# EAGLE design Osillatore Variabile Intonazione (EAGLE 7.6.0)
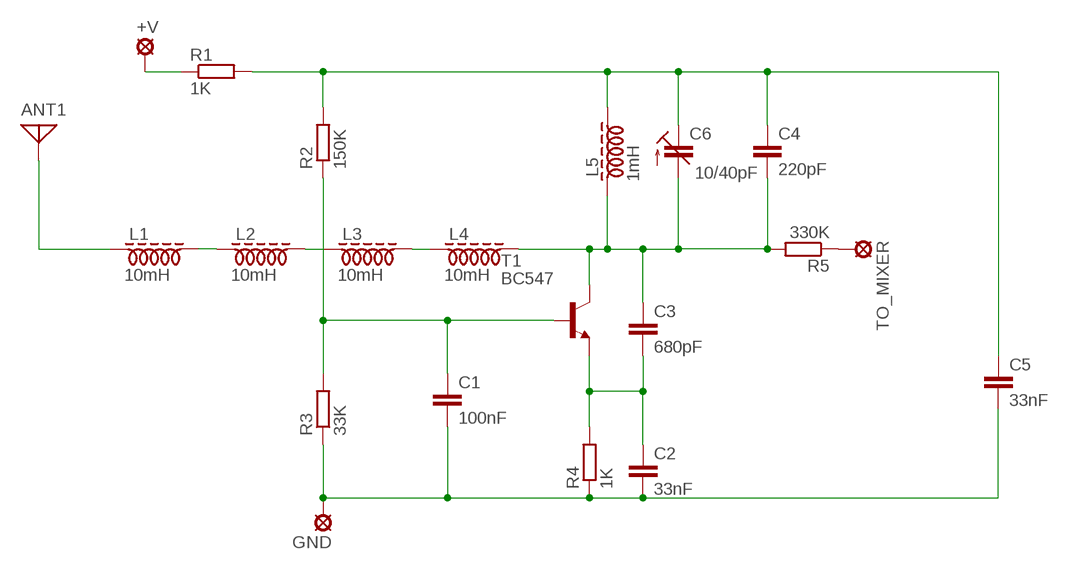
[diagram p0: schematic, sheet 1]

## Parts
+V  LSP10  [LSP10]
ANT1  ANTENNA  [PAD-01]
C1  100nF  C-EU025-060X050  [C025-060X050]
C2  33nF  C-EU025-060X050  [C025-060X050]
C3  680pF  C-EU025-060X050  [C025-060X050]
C4  220pF  C-EU025-060X050  [C025-060X050]
C5  33nF  C-EU025-060X050  [C025-060X050]
C6  10/40pF  C-TRIMM3008  [3008]
GND  LSP10  [LSP10]
L1  10mH  Z28/70CW  [Z28/7]
L2  10mH  Z28/70CW  [Z28/7]
L3  10mH  Z28/70CW  [Z28/7]
L4  10mH  Z28/70CW  [Z28/7]
L5  1mH  Z28/70CW  [Z28/7]
R1  1K  R-EU_0207/7  [0207/7]
R2  150K  R-EU_0207/7  [0207/7]
R3  33K  R-EU_0207/7  [0207/7]
R4  1K  R-EU_0207/7  [0207/7]
R5  330K  R-EU_0207/7  [0207/7]
T1  BC547  [TO92]
TO_MIXER  LSP10  [LSP10]

## Nets
N$1: C4.1 C5.1 C6.+(E) L5.2 R1.2 R2.2
N$2: ANT1.1 L1.1
N$3: L1.2 L2.1
N$4: L2.2 L3.1
N$5: L3.2 L4.1
N$6: C3.1 C4.2 C6.-(A) L4.2 L5.1 R5.2 T1.3(C)
N$7: C1.1 R2.1 R3.2 T1.2(B)
N$8: +V.MP R1.1
N$9: C2.1 C3.2 R4.2 T1.1(E)
N$12: R5.1 TO_MIXER.MP
N$14: C1.2 C2.2 C5.2 GND.MP R3.1 R4.1

## Library data of the parts
+V GND TO_MIXER = solpad:LSP10: SOLDER PAD drill 1.0 mm, distributor Buerklin, 12H555
ANT1 = discrete:ANTENNA: Antenna
C1-C5 = resistor:C-EU: CAPACITOR, European symbol
C6 = c-trimm:C-TRIMM: Trimm capacitor; OC_FARNELL: unknown; OC_NEWARK: unknown
L1-L5 = inductor-neosid:Z?CW: CHOKE free-suspension choke/nominal inductance winding clockwise; OC_FARNELL: unknown; OC_NEWARK: unknown
R1-R5 = rcl:R-EU_: RESISTOR, European symbol
T1 = transistor:BC547: NPN TRANSISTOR

## Board
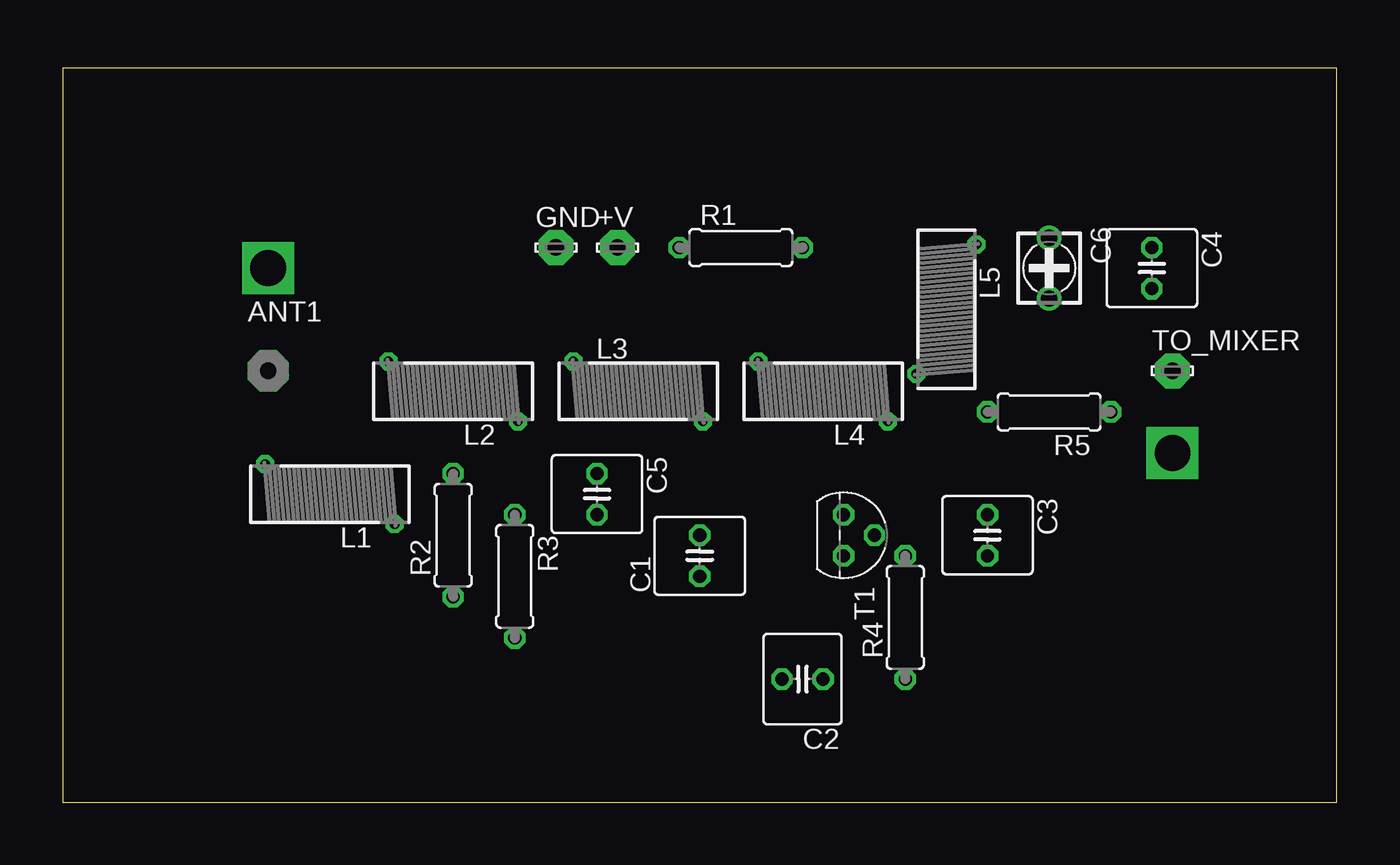
[diagram p1: board, top side]
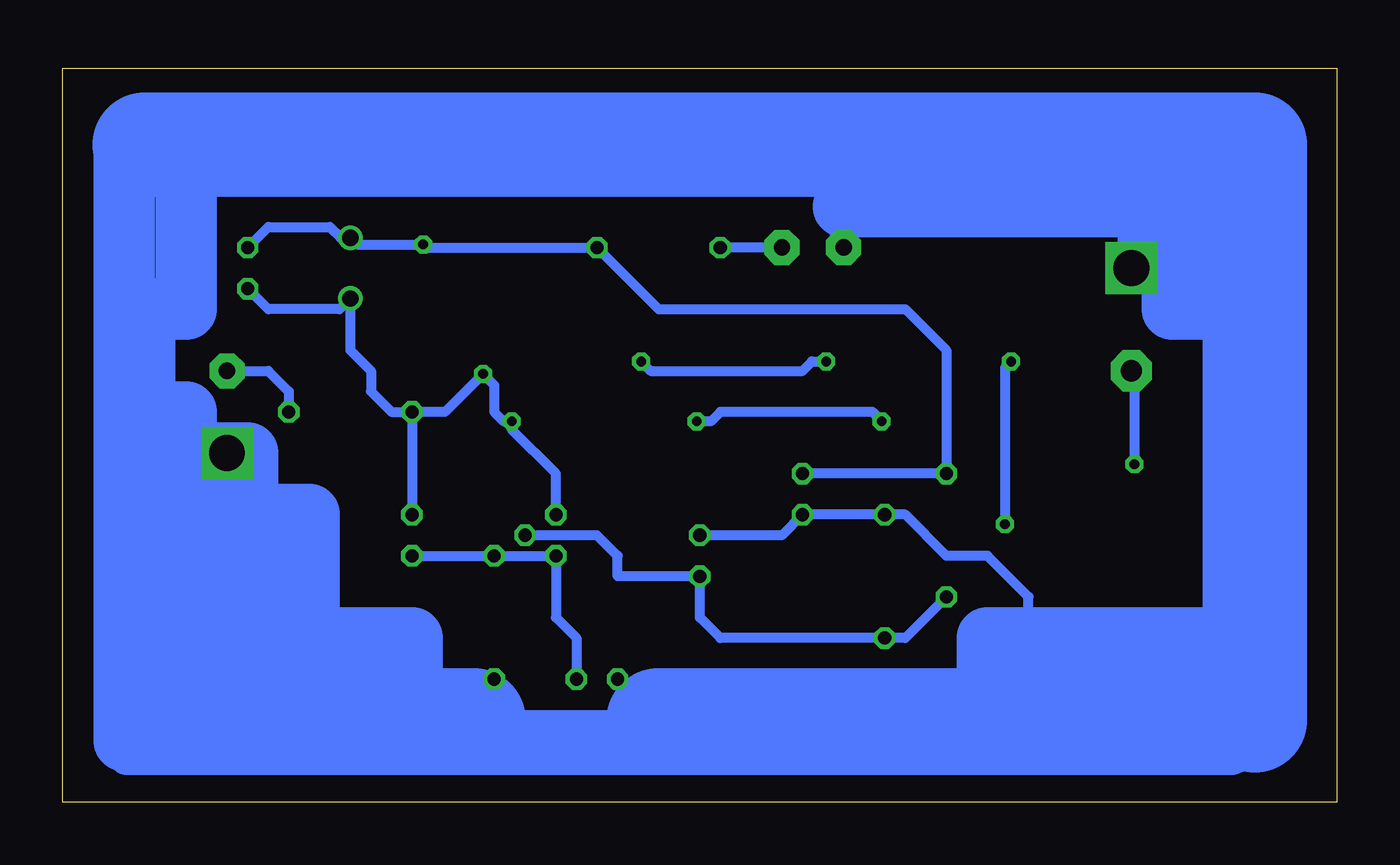
[diagram p2: board, bottom side, seen from below]

Size 78.72 x 45.39 mm. Coordinates in mm from the lower left corner, seen from the top.
Outline: 0,0 78.72,0 78.72,45.39 0,45.39 0,0
Copper layers (1*16): Top 0.035mm / dielectric 1.5mm / Bottom 0.035mm
Design rules "default": minimum track width 10mil, minimum drill 24mil, track to track 8mil, track to pad 8mil, pad to pad 8mil, via to via 8mil, smd to smd 8mil, copper to edge 40mil, drill to drill 8mil, minimum pad ring 10mil, minimum via ring 8mil, stop-mask expansion 4mil, vias tented up to drill 0mil, thermal gap 10mil

### Footprints (pad centres in the part's own frame; a part is rotated, then mirrored left to right if it is on the bottom)
LSP10 = drill 1.016 pad 2.159 octagon: MP 0,0
PAD-01 = drill 1.321 pad 2.54 octagon: 1 0,0
C025-060X050 = drill 0.813 octagon: 1 -1.27,0; 2 1.27,0
3008 = drill 1: + -1.875,0; - 1.875,0
Z28/7 = drill 0.6 octagon: 1 4,-1.85; 2 -4,1.85
0207/7 = drill 0.813 octagon: 1 -3.81,0; 2 3.81,0
TO92 = drill 0.813 octagon: 1 1.27,0; 2 0,1.905; 3 -1.27,0

### Placement (x,y rotation side)
+V  34.29,34.29 0 top
ANT1  12.7,26.67 0 top
C1  39.37,15.24 90 top
C2  45.72,7.62 180 top
C3  57.15,16.51 270 top
C4  67.31,33.02 270 top
C5  33.02,19.05 270 top
C6  60.96,33.02 270 top
GND  30.48,34.29 0 top
L1  16.51,19.05 180 top
L2  24.13,25.4 180 top
L3  35.56,25.4 0 top
L4  46.99,25.4 180 top
L5  54.61,30.48 270 top
R1  41.91,34.29 0 top
R2  24.13,16.51 90 top
R3  27.94,13.97 270 top
R4  52.07,11.43 90 top
R5  60.96,24.13 180 top
T1  48.26,16.51 270 top
TO_MIXER  68.58,26.67 0 top

### Tracks (layer width: path | path; a pad name or v marks a point on that pad's centre or on a via)
N$1
  Bottom 0.61: C5.1 R2.2 24.13,27.94 26.67,30.48 41.91,30.48 R1.2 56.27,34.29 L5.2 60.54,34.48 C6.+ 61.57,34.89 62.23,35.56 66.04,35.56 C4.1
N$2
  Bottom 0.61: ANT1.1 12.51,26.48 L1.1
N$3
  Bottom 0.61: L2.1 20.51,26.87 L1.2
N$4
  Bottom 0.61: L2.2 28.71,24.13 38.1,24.13 38.68,23.55 L3.1
N$5
  Bottom 0.61: L4.1 42.41,26.67 33.02,26.67 32.44,27.25 L3.2
N$6
  Bottom 0.61: R5.2 55.11,24.13 L5.1 52.07,25.79 52.07,24.13 51.49,23.55 L4.2 50.99,23.05 48.26,20.32 T1.3 | R5.2 C3.1 | R5.2 58.42,24.13 59.69,25.4 59.69,26.67 60.96,27.94 C6.- 61.62,30.48 66.04,30.48 C4.2
N$7
  Bottom 0.61: R2.1 26.67,10.16 R3.2 38.1,10.16 39.37,11.43 C1.1 44.45,13.97 44.45,15.24 45.72,16.51 T1.2
N$8
  Bottom 0.61: +V.MP R1.1
N$9
  Bottom 0.61: C3.2 R4.2 T1.1 48.26,11.43 46.99,10.16 C2.1
N$10
  Bottom 6.452: 53.34,5.08 72.39,5.08 72.39,19.05
N$11
  Bottom 3.81: 71.12,38.1 71.12,30.48 73.66,30.48 73.66,24.13 71.12,24.13 71.12,20.32 68.58,20.32 68.58,19.05
N$12
  Bottom 0.61: TO_MIXER.MP 66.04,26.67 64.77,25.4 R5.1
N$14  (via drill 2.2)
  Bottom 0.61: R4.1 52.07,2.54 | C1.2 34.29,16.51 C5.2 R3.1 26.67,17.78 24.13,15.24 21.59,15.24 19.05,12.7 19.05,10.16 19.05,2.54 | C2.2 43.18,6.35 43.18,3.81 43.18,2.54
  Bottom 1.676: 12.7,41.91 6.35,41.91 6.35,40.64 6.35,36.83 6.35,30.48 6.35,5.08 6.35,2.54 19.05,2.54 43.18,2.54 52.07,2.54 74.93,2.54 74.93,3.81 74.93,21.59 | 12.7,41.91 30.48,41.91 | 30.48,41.91 74.93,41.91 74.93,40.64 | 74.93,22.86 74.93,21.59 | v12.7,33.02 12.7,41.91 | GND.MP 30.48,36.83 30.48,41.91 | v68.58,21.59 69.85,21.59 74.93,21.59
  Bottom 3.81: 67.31,19.05 67.31,21.59 69.85,21.59 | 72.39,20.32 74.93,20.32 | 74.93,20.32 74.93,22.86 74.93,40.64 | 6.35,36.83 30.48,36.83 | 6.35,30.48 10.16,30.48 10.16,35.56 | 7.62,10.16 19.05,10.16 21.59,10.16 21.59,7.62 | 43.18,3.81 57.15,3.81 57.15,10.16 68.58,10.16 | 68.58,10.16 68.58,8.89 | 68.58,10.16 68.58,17.78 63.5,17.78 63.5,11.43 66.04,11.43 66.04,15.24 | 74.93,20.32 74.93,3.81
  Bottom 6.452: 6.35,5.08 41.91,5.08 | 73.66,40.64 6.35,40.64 5.08,40.64 5.08,5.08